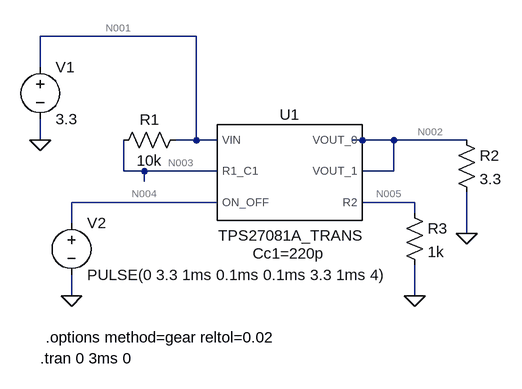
[diagram p0: schematic LoadSwitch.asc]
LoadSwitch.asc, the LTspice schematic file:
Version 4.1
SHEET 1 880 680
WIRE 80 -32 -160 -32
WIRE -160 16 -160 -32
WIRE -160 128 -160 96
WIRE 80 128 80 -32
WIRE 80 128 48 128
WIRE 112 128 80 128
WIRE 336 128 320 128
WIRE 384 128 336 128
WIRE 496 128 384 128
WIRE -32 176 -32 128
WIRE 0 176 -32 176
WIRE 112 176 0 176
WIRE 384 176 384 128
WIRE 384 176 336 176
WIRE 0 192 0 176
WIRE 112 224 -112 224
WIRE 416 224 336 224
WIRE 416 240 416 224
WIRE -112 256 -112 224
WIRE 496 272 496 208
WIRE -112 368 -112 336
WIRE 416 368 416 320
FLAG -160 128 0
FLAG -112 368 0
FLAG 496 272 0
FLAG 416 368 0
SYMBOL TPS27081A_TRANS 224 160 R0
SYMATTR InstName U1
SYMBOL res 64 112 R90
WINDOW 0 0 56 VBottom 2
WINDOW 3 32 56 VTop 2
SYMATTR InstName R1
SYMATTR Value 10k
SYMBOL voltage -160 0 R0
WINDOW 123 0 0 Left 0
WINDOW 39 0 0 Left 0
SYMATTR InstName V1
SYMATTR Value 3.3
SYMBOL voltage -112 240 R0
WINDOW 123 0 0 Left 0
WINDOW 39 0 0 Left 0
SYMATTR InstName V2
SYMATTR Value PULSE(0 3.3 1ms 0.1ms 0.1ms 3.3 1ms 4)
SYMBOL res 480 112 R0
SYMATTR InstName R2
SYMATTR Value 3.3
SYMBOL res 400 224 R0
SYMATTR InstName R3
SYMATTR Value 1k
TEXT -160 464 Left 2 !.tran 0 3ms 0
TEXT -152 432 Left 2 !.options method=gear reltol=0.02

The netlist it stands for:
* LoadSwitch.asc
X§U1 N004 N005 N003 N001 N002 N002 TPS27081A_TRANS Cc1=220p  ; pins ON_OFF R2 R1_C1 VIN VOUT_0 VOUT_1
R1 N001 N003 10k
V1 N001 0 3.3
V2 N004 0 PULSE(0 3.3 1ms 0.1ms 0.1ms 3.3 1ms 4)
R2 N002 0 3.3
R3 N005 0 1k
.tran 0 3ms 0
.options method=gear reltol=0.02
.lib C:\Main Engineering\Engineering\Attitude Determination Card\Simulations\Load Switch\TPS27081A_TRANS.LIB
.backanno
.end

* Results of the author's LTspice run, read from the files saved beside the schematic
* Operating Point, zero values left out:
*   V(n001) = 3.3 V
*   V(n003) = 3.3 V
*   V(n005) = 13.2 µV
*   I(R1) = 13.2 nA
*   I(R2) = 13.21 pA
*   I(R3) = 13.2 nA
*   I(V1) = -63.22 nA
*   Ix(u1:r1_c1) = 13.2 nA
*   Ix(u1:r2) = -13.2 nA
*   Ix(u1:vin) = 50.01 nA
*   Ix(u1:vout_0) = -6.606 pA
*   Ix(u1:vout_1) = -6.606 pA
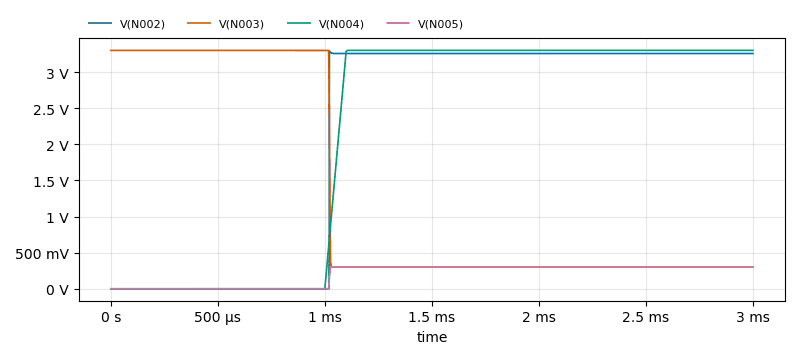
[diagram p1: Transient Analysis of LoadSwitch.asc, plotted from the saved traces]
* Transient Analysis, 1 run:
*   V(N002): min -11.45 µV, max 3.29 V, average 2.149 V, rms 2.645 V, last 3.256 V
*   V(N003): min 300.3 mV, max 3.3 V, average 1.322 V, rms 1.941 V, last 300.3 mV
*   V(N004): min 0 V, max 3.3 V, average 2.145 V, rms 2.65 V, last 3.3 V
*   V(N005): min 13.2 µV, max 305.8 mV, average 197.8 mV, rms 243.5 mV, last 300 mV